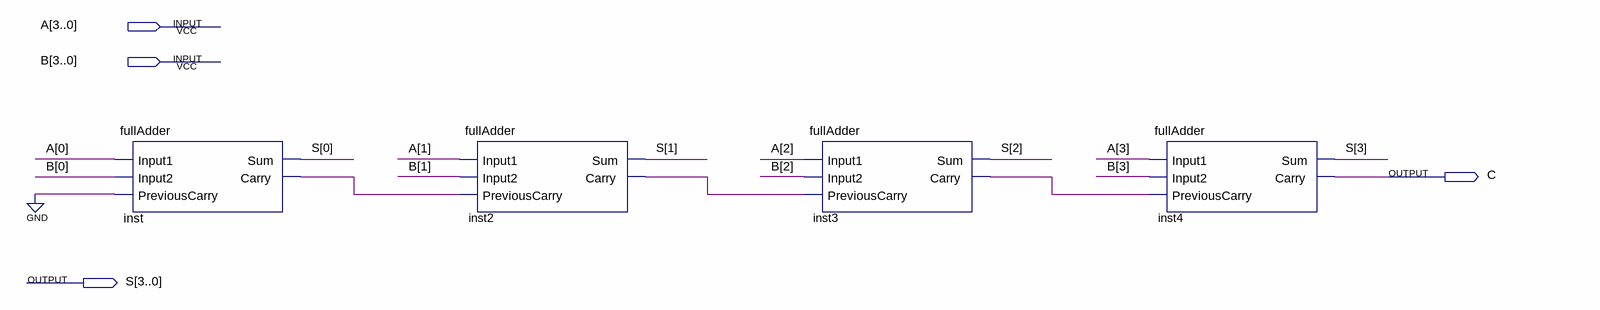
[diagram p0: schematic sheet]
// Quartus schematic fullAdder4bit.bdf as structural Verilog: 4 symbols, 4 pins
module fullAdder4bit (
  input  [3:0] A,
  input  [3:0] B,
  output C,
  output [3:0] S
);

  wire inst2_carry, inst3_carry, inst_carry;

  fullAdder inst (.Input1(A[0]), .Input2(B[0]), .PreviousCarry(1'b0), .Sum(S[0]), .Carry(inst_carry));
  fullAdder inst2 (.Input1(A[1]), .Input2(B[1]), .PreviousCarry(inst_carry), .Sum(S[1]), .Carry(inst2_carry));
  fullAdder inst3 (.Input1(A[2]), .Input2(B[2]), .PreviousCarry(inst2_carry), .Sum(S[2]), .Carry(inst3_carry));
  fullAdder inst4 (.Input1(A[3]), .Input2(B[3]), .PreviousCarry(inst3_carry), .Sum(S[3]), .Carry(C));
endmodule
